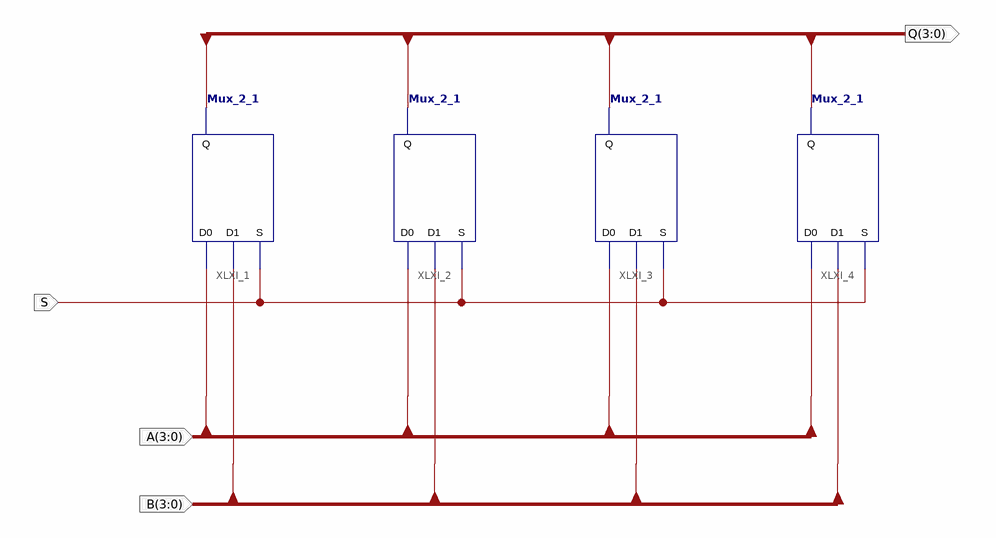
[diagram p0: schematic sheet 1]
// Xilinx ISE schematic Mux_4_bit_2_way.sch (spartan3e) as structural Verilog: 4 symbols, 4 ports
module Mux_4_bit_2_way (
  input  S,
  input  [3:0] A,
  input  [3:0] B,
  output [3:0] Q
);

  Mux_2_1 XLXI_1 (.D0(A[0]), .D1(B[0]), .Q(Q[0]), .S(S));
  Mux_2_1 XLXI_2 (.D0(A[1]), .D1(B[1]), .Q(Q[1]), .S(S));
  Mux_2_1 XLXI_3 (.D0(A[2]), .D1(B[2]), .Q(Q[2]), .S(S));
  Mux_2_1 XLXI_4 (.D0(A[3]), .D1(B[3]), .Q(Q[3]), .S(S));
endmodule
